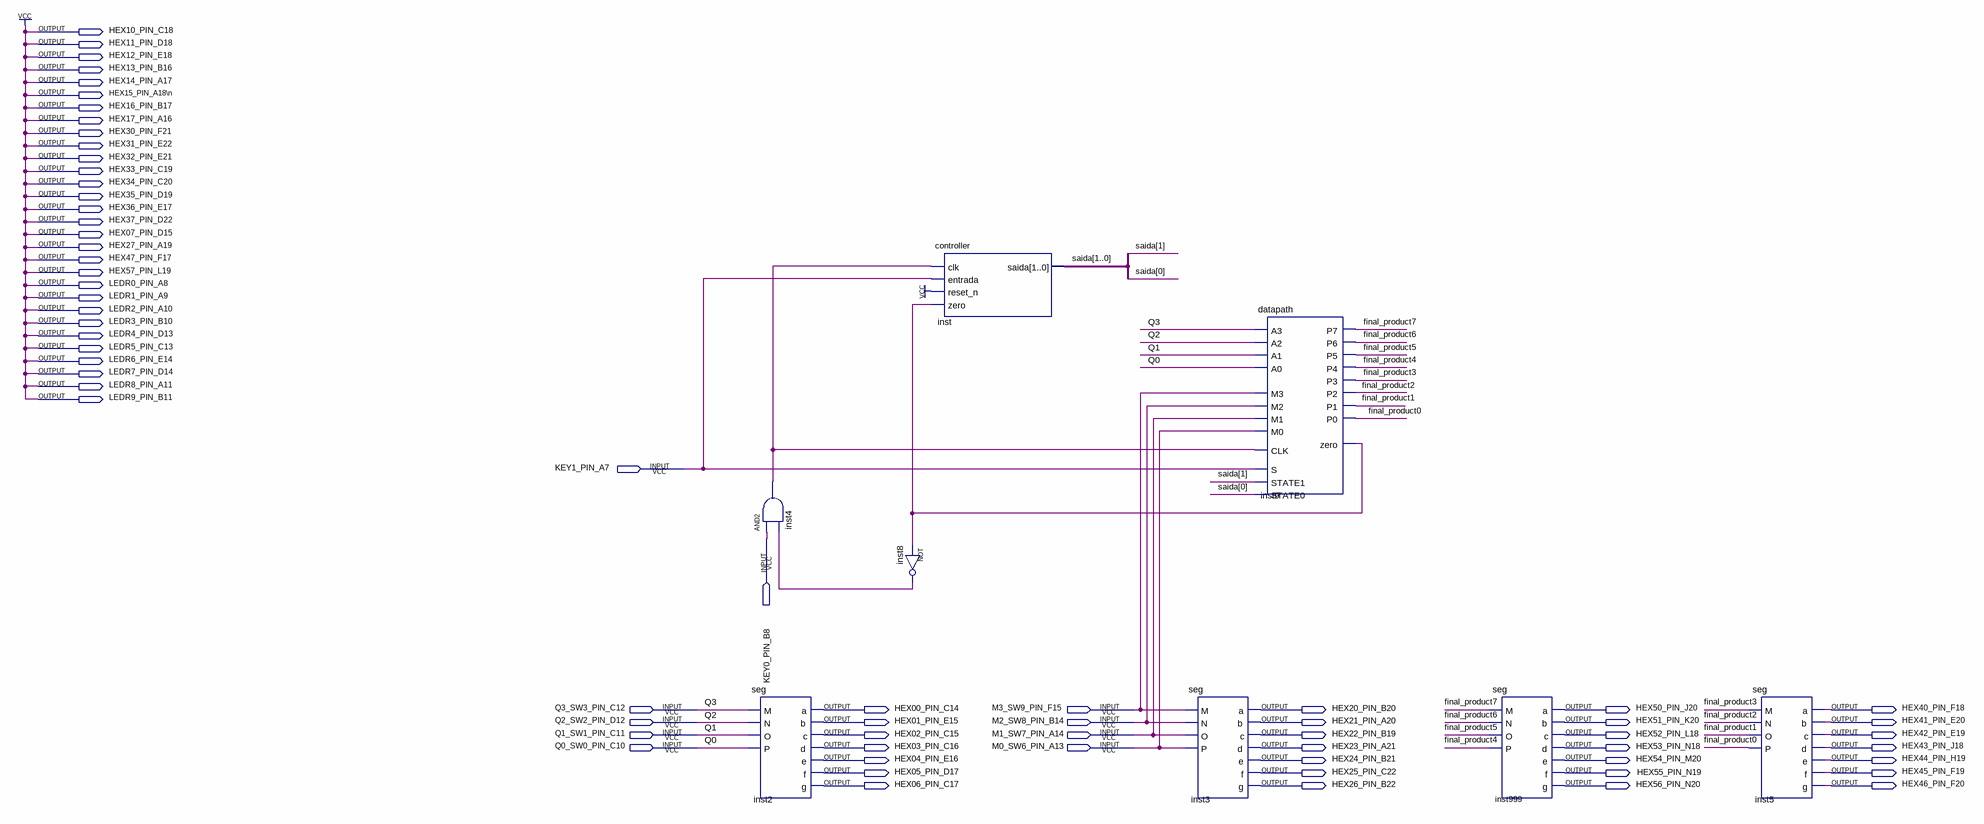
[diagram p0: schematic sheet]
// Quartus schematic 4bit_multiplier.bdf as structural Verilog: 8 symbols, 68 pins
module \4bit_multiplier  (
  input  KEY1_PIN_A7,
  input  KEY0_PIN_B8,
  input  Q3_SW3_PIN_C12,
  input  M3_SW9_PIN_F15,
  input  Q2_SW2_PIN_D12,
  input  M2_SW8_PIN_B14,
  input  Q1_SW1_PIN_C11,
  input  M1_SW7_PIN_A14,
  input  Q0_SW0_PIN_C10,
  input  M0_SW6_PIN_A13,
  output HEX10_PIN_C18,
  output HEX11_PIN_D18,
  output HEX12_PIN_E18,
  output HEX13_PIN_B16,
  output HEX14_PIN_A17,
  output \HEX15_PIN_A18\n ,
  output HEX16_PIN_B17,
  output HEX17_PIN_A16,
  output HEX30_PIN_F21,
  output HEX31_PIN_E22,
  output HEX32_PIN_E21,
  output HEX33_PIN_C19,
  output HEX34_PIN_C20,
  output HEX35_PIN_D19,
  output HEX36_PIN_E17,
  output HEX37_PIN_D22,
  output HEX07_PIN_D15,
  output HEX27_PIN_A19,
  output HEX47_PIN_F17,
  output HEX57_PIN_L19,
  output LEDR0_PIN_A8,
  output LEDR1_PIN_A9,
  output LEDR2_PIN_A10,
  output LEDR3_PIN_B10,
  output LEDR4_PIN_D13,
  output LEDR5_PIN_C13,
  output LEDR6_PIN_E14,
  output LEDR7_PIN_D14,
  output LEDR8_PIN_A11,
  output LEDR9_PIN_B11,
  output HEX00_PIN_C14,
  output HEX20_PIN_B20,
  output HEX50_PIN_J20,
  output HEX40_PIN_F18,
  output HEX01_PIN_E15,
  output HEX21_PIN_A20,
  output HEX51_PIN_K20,
  output HEX41_PIN_E20,
  output HEX02_PIN_C15,
  output HEX22_PIN_B19,
  output HEX52_PIN_L18,
  output HEX42_PIN_E19,
  output HEX03_PIN_C16,
  output HEX23_PIN_A21,
  output HEX53_PIN_N18,
  output HEX43_PIN_J18,
  output HEX04_PIN_E16,
  output HEX24_PIN_B21,
  output HEX54_PIN_M20,
  output HEX44_PIN_H19,
  output HEX05_PIN_D17,
  output HEX25_PIN_C22,
  output HEX55_PIN_N19,
  output HEX45_PIN_F19,
  output HEX06_PIN_C17,
  output HEX26_PIN_B22,
  output HEX56_PIN_N20,
  output HEX46_PIN_F20
);

  wire final_product0, final_product1, final_product2, final_product3, final_product4, final_product5,
       final_product6, final_product7, inst4_out, inst8_out, inst9_zero;
  wire [1:0] saida;

  and inst4 (inst4_out, KEY0_PIN_B8, inst8_out);
  seg inst2 (
    .M(Q3_SW3_PIN_C12), .N(Q2_SW2_PIN_D12), .O(Q1_SW1_PIN_C11), .P(Q0_SW0_PIN_C10), .a(HEX00_PIN_C14),
    .b(HEX01_PIN_E15), .c(HEX02_PIN_C15), .d(HEX03_PIN_C16), .e(HEX04_PIN_E16), .f(HEX05_PIN_D17),
    .g(HEX06_PIN_C17));
  not inst8 (inst8_out, inst9_zero);
  controller inst (.clk(inst4_out), .entrada(KEY1_PIN_A7), .reset_n(1'b1), .zero(inst9_zero), .saida(saida));
  seg inst3 (
    .M(M3_SW9_PIN_F15), .N(M2_SW8_PIN_B14), .O(M1_SW7_PIN_A14), .P(M0_SW6_PIN_A13), .a(HEX20_PIN_B20),
    .b(HEX21_PIN_A20), .c(HEX22_PIN_B19), .d(HEX23_PIN_A21), .e(HEX24_PIN_B21), .f(HEX25_PIN_C22),
    .g(HEX26_PIN_B22));
  datapath inst9 (
    .A3(Q3_SW3_PIN_C12), .A2(Q2_SW2_PIN_D12), .A0(Q0_SW0_PIN_C10), .A1(Q1_SW1_PIN_C11), .M3(M3_SW9_PIN_F15),
    .M2(M2_SW8_PIN_B14), .M1(M1_SW7_PIN_A14), .M0(M0_SW6_PIN_A13), .CLK(inst4_out), .S(KEY1_PIN_A7),
    .STATE1(saida[1]), .STATE0(saida[0]), .P7(final_product7), .P6(final_product6), .P5(final_product5),
    .zero(inst9_zero), .P4(final_product4), .P3(final_product3), .P2(final_product2), .P1(final_product1),
    .P0(final_product0));
  seg inst999 (
    .M(final_product7), .N(final_product6), .O(final_product5), .P(final_product4), .a(HEX50_PIN_J20),
    .b(HEX51_PIN_K20), .c(HEX52_PIN_L18), .d(HEX53_PIN_N18), .e(HEX54_PIN_M20), .f(HEX55_PIN_N19),
    .g(HEX56_PIN_N20));
  seg inst5 (
    .M(final_product3), .N(final_product2), .O(final_product1), .P(final_product0), .a(HEX40_PIN_F18),
    .b(HEX41_PIN_E20), .c(HEX42_PIN_E19), .d(HEX43_PIN_J18), .e(HEX44_PIN_H19), .f(HEX45_PIN_F19),
    .g(HEX46_PIN_F20));

  assign HEX07_PIN_D15 = 1'b1;
  assign HEX10_PIN_C18 = 1'b1;
  assign HEX11_PIN_D18 = 1'b1;
  assign HEX12_PIN_E18 = 1'b1;
  assign HEX13_PIN_B16 = 1'b1;
  assign HEX14_PIN_A17 = 1'b1;
  assign \HEX15_PIN_A18\n  = 1'b1;
  assign HEX16_PIN_B17 = 1'b1;
  assign HEX17_PIN_A16 = 1'b1;
  assign HEX27_PIN_A19 = 1'b1;
  assign HEX30_PIN_F21 = 1'b1;
  assign HEX31_PIN_E22 = 1'b1;
  assign HEX32_PIN_E21 = 1'b1;
  assign HEX33_PIN_C19 = 1'b1;
  assign HEX34_PIN_C20 = 1'b1;
  assign HEX35_PIN_D19 = 1'b1;
  assign HEX36_PIN_E17 = 1'b1;
  assign HEX37_PIN_D22 = 1'b1;
  assign HEX47_PIN_F17 = 1'b1;
  assign HEX57_PIN_L19 = 1'b1;
  assign LEDR0_PIN_A8 = 1'b1;
  assign LEDR1_PIN_A9 = 1'b1;
  assign LEDR2_PIN_A10 = 1'b1;
  assign LEDR3_PIN_B10 = 1'b1;
  assign LEDR4_PIN_D13 = 1'b1;
  assign LEDR5_PIN_C13 = 1'b1;
  assign LEDR6_PIN_E14 = 1'b1;
  assign LEDR7_PIN_D14 = 1'b1;
  assign LEDR8_PIN_A11 = 1'b1;
  assign LEDR9_PIN_B11 = 1'b1;

  // Other names for the same wires on the sheet: Q0 = Q0_SW0_PIN_C10; Q1 = Q1_SW1_PIN_C11; Q2 = Q2_SW2_PIN_D12;
  //   Q3 = Q3_SW3_PIN_C12
endmodule
